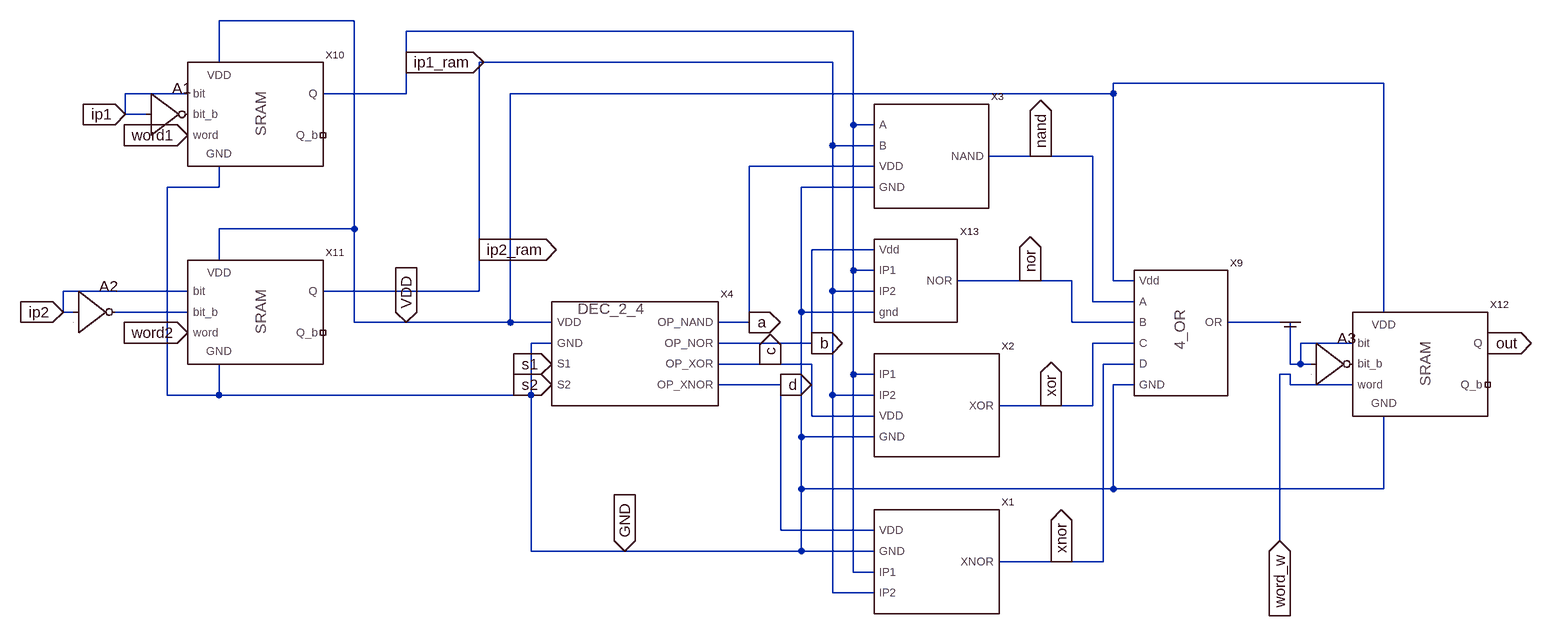
[diagram p0: schematic sg3114.asc]
sg3114.asc, the LTspice schematic file:
Version 4
SHEET 1 984 984
WIRE -960 -272 -1168 -272
WIRE -192 -256 -880 -256
WIRE -1168 -208 -1168 -272
WIRE -880 -208 -880 -256
WIRE -224 -208 -768 -208
WIRE 624 -176 208 -176
WIRE -1216 -160 -1312 -160
WIRE -880 -160 -880 -208
WIRE -880 -160 -1008 -160
WIRE 208 -160 208 -176
WIRE 208 -160 -720 -160
WIRE -1312 -128 -1312 -160
WIRE -1280 -128 -1312 -128
WIRE -192 -112 -192 -256
WIRE -160 -112 -192 -112
WIRE -224 -80 -224 -208
WIRE -160 -80 -224 -80
WIRE 96 -64 16 -64
WIRE 176 -64 96 -64
WIRE -160 -48 -352 -48
WIRE -1168 -16 -1168 -48
WIRE -1168 -16 -1248 -16
WIRE -160 -16 -272 -16
WIRE -960 48 -960 -272
WIRE -960 48 -1168 48
WIRE -768 80 -768 -208
WIRE -160 80 -256 80
WIRE -1168 96 -1168 48
WIRE -192 112 -192 -112
WIRE -160 112 -192 112
WIRE 80 128 -32 128
WIRE 144 128 80 128
WIRE 208 128 208 -160
WIRE 240 128 208 128
WIRE -1216 144 -1408 144
WIRE -768 144 -768 80
WIRE -768 144 -1008 144
WIRE -224 144 -224 -80
WIRE -160 144 -224 144
WIRE 176 160 176 -64
WIRE 240 160 176 160
WIRE -1408 176 -1408 144
WIRE -1392 176 -1408 176
WIRE -1216 176 -1328 176
WIRE -272 176 -272 -16
WIRE -160 176 -272 176
WIRE 624 176 624 -176
WIRE -960 192 -960 48
WIRE -880 192 -960 192
WIRE -720 192 -720 -160
WIRE -720 192 -880 192
WIRE -656 192 -720 192
WIRE -352 192 -352 -48
WIRE -352 192 -400 192
WIRE 144 192 144 128
WIRE 240 192 144 192
WIRE 480 192 384 192
WIRE -656 224 -688 224
WIRE -256 224 -256 80
WIRE -256 224 -400 224
WIRE 240 224 176 224
WIRE 576 224 496 224
WIRE -320 256 -400 256
WIRE -256 256 -320 256
WIRE 240 256 192 256
WIRE 480 256 480 192
WIRE 496 256 496 224
WIRE 496 256 480 256
WIRE 512 256 496 256
WIRE -192 272 -192 112
WIRE -160 272 -192 272
WIRE 480 272 464 272
WIRE -304 288 -400 288
WIRE 240 288 208 288
WIRE 480 288 480 272
WIRE 576 288 480 288
WIRE -1248 304 -1248 -16
WIRE -1168 304 -1168 256
WIRE -1168 304 -1248 304
WIRE -688 304 -688 224
WIRE -688 304 -1168 304
WIRE -224 304 -224 144
WIRE -160 304 -224 304
WIRE 112 320 32 320
WIRE 176 320 176 224
WIRE 176 320 112 320
WIRE -256 336 -256 256
WIRE -160 336 -256 336
WIRE -272 368 -272 176
WIRE -160 368 -272 368
WIRE -272 448 -272 368
WIRE 208 448 208 288
WIRE 208 448 -272 448
WIRE 624 448 624 336
WIRE 624 448 208 448
WIRE -304 512 -304 288
WIRE -160 512 -304 512
WIRE 464 528 464 272
WIRE -688 544 -688 304
WIRE -544 544 -688 544
WIRE -272 544 -272 448
WIRE -272 544 -544 544
WIRE -160 544 -272 544
WIRE 128 560 32 560
WIRE 192 560 192 256
WIRE 192 560 128 560
WIRE -192 576 -192 272
WIRE -160 576 -192 576
WIRE -224 608 -224 304
WIRE -160 608 -224 608
FLAG 96 -64 nand
IOPIN 96 -64 Out
FLAG 80 128 nor
IOPIN 80 128 Out
FLAG 112 320 xor
IOPIN 112 320 Out
FLAG 128 560 xnor
IOPIN 128 560 Out
FLAG -352 192 a
IOPIN -352 192 Out
FLAG -256 224 b
IOPIN -256 224 Out
FLAG -320 256 c
IOPIN -320 256 Out
FLAG -304 288 d
IOPIN -304 288 Out
FLAG -1216 -96 word1
IOPIN -1216 -96 In
FLAG -768 80 ip2_ram
IOPIN -768 80 Out
FLAG -880 -208 ip1_ram
IOPIN -880 -208 Out
FLAG 784 224 out
IOPIN 784 224 Out
FLAG 480 192 com
IOPIN 480 192 Out
FLAG 464 528 word_w
IOPIN 464 528 In
FLAG -1312 -128 ip1
IOPIN -1312 -128 In
FLAG -1408 176 ip2
IOPIN -1408 176 In
FLAG -656 256 s1
IOPIN -656 256 In
FLAG -656 288 s2
IOPIN -656 288 In
FLAG -544 544 GND
IOPIN -544 544 In
FLAG -880 192 VDD
IOPIN -880 192 In
FLAG -1216 208 word2
IOPIN -1216 208 In
SYMBOL XNOR -48 560 R0
SYMATTR InstName X1
SYMBOL XOR -64 320 R0
SYMATTR InstName X2
SYMBOL NAND -80 -64 R0
SYMATTR InstName X3
SYMBOL DEC_2_4 -528 240 R0
SYMATTR InstName X4
SYMBOL Digital\\inv -1280 -192 R0
SYMATTR InstName A1
SYMBOL Digital\\inv -1392 112 R0
SYMATTR InstName A2
SYMBOL Digital\\inv 512 192 R0
SYMATTR InstName A3
SYMBOL OR_4IP 272 192 R0
SYMATTR InstName X9
SYMBOL sram -1104 -128 R0
SYMATTR InstName X10
SYMBOL sram -1104 176 R0
SYMATTR InstName X11
SYMBOL sram 688 256 R0
SYMATTR InstName X12
SYMBOL nor -144 112 R0
SYMATTR InstName X13

The netlist it stands for:
* sg3114.asc
XX1 ip1_ram ip2_ram xnor d GND XNOR  ; pins IP1 IP2 XNOR VDD GND
XX2 ip1_ram ip2_ram c GND xor XOR  ; pins IP1 IP2 VDD GND XOR
XX3 ip1_ram ip2_ram a GND nand NAND  ; pins A B VDD GND NAND
XX4 VDD GND s1 s2 a b c d DEC_2_4  ; pins VDD GND S1 S2 OP_NAND OP_NOR OP_XOR OP_XNOR
A1 ip1 0 0 0 0 P001 0 0 BUF
A2 ip2 0 0 0 0 N001 0 0 BUF
A3 com 0 0 0 0 P002 0 0 BUF
XX9 nand nor xor xnor VDD GND com OR_4IP  ; pins A B C D Vdd GND OR
XX10 ip1 P001 word1 VDD GND ip1_ram NC_01 sram  ; pins bit bit_b word VDD GND Q Q_b
XX11 ip2 N001 word2 VDD GND ip2_ram NC_02 sram  ; pins bit bit_b word VDD GND Q Q_b
XX12 com P002 word_w VDD GND out NC_03 sram  ; pins bit bit_b word VDD GND Q Q_b
XX13 ip1_ram ip2_ram b GND nor nor  ; pins IP1 IP2 Vdd gnd NOR
.backanno
.end